# Altium schematic sheet AD9834.SchDoc
size A4
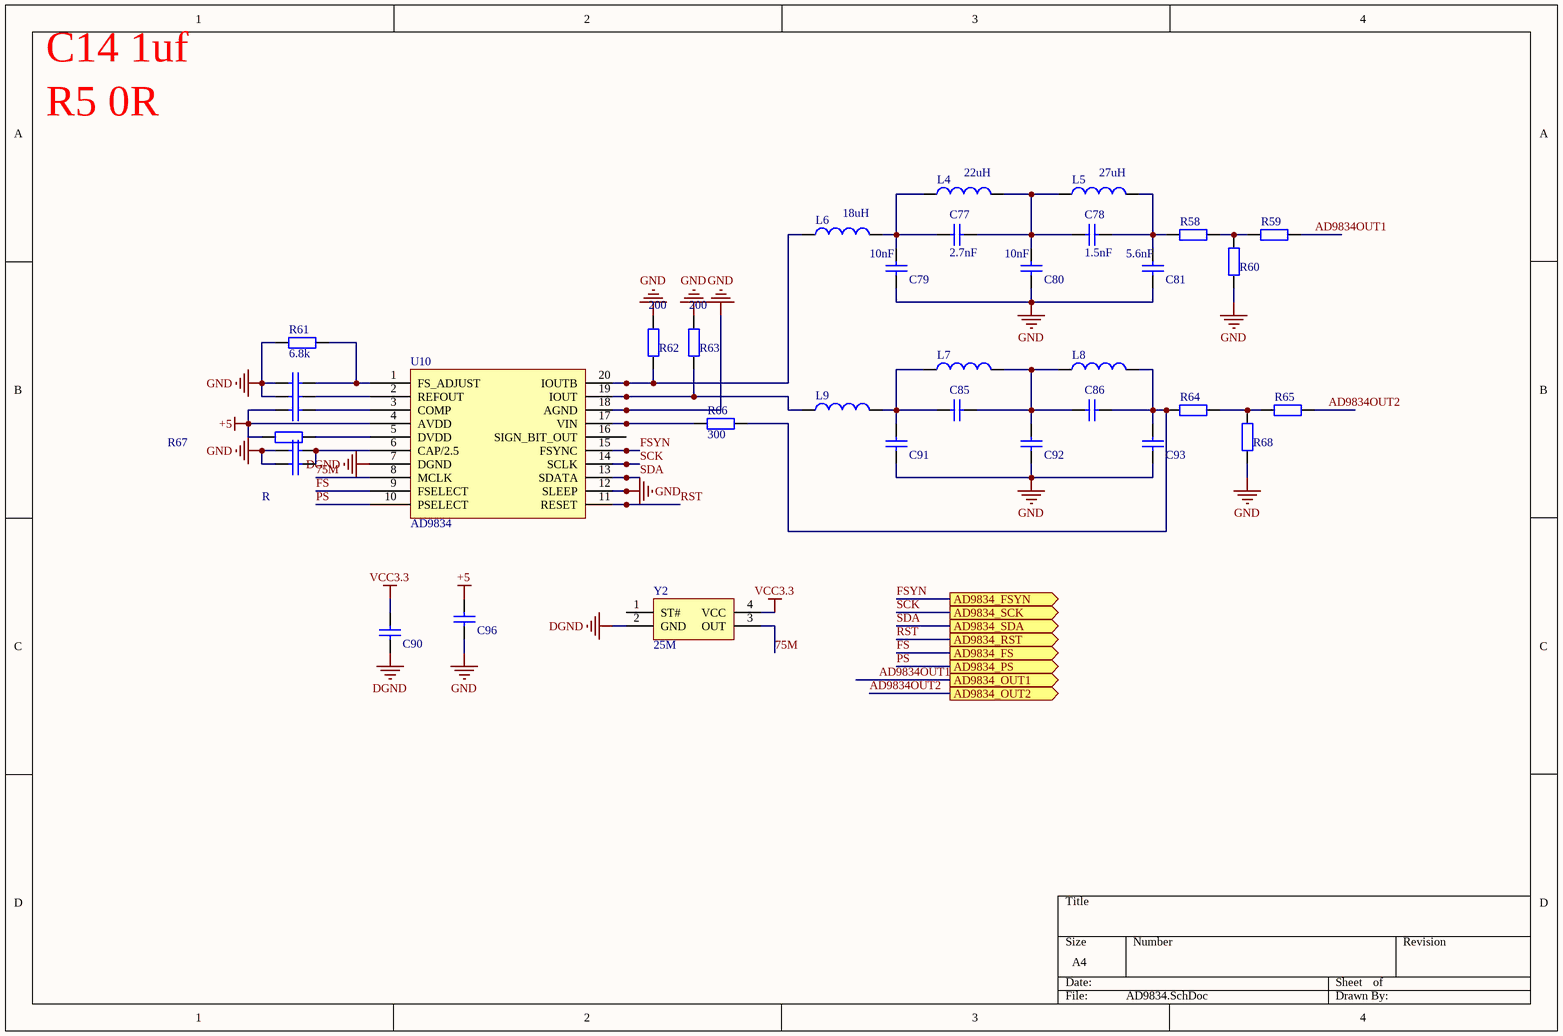
[diagram p0: AD9834.SchDoc]

## Parts
C77  2.7nF  [0603_C]
C78  1.5nF  [0603_C]
C79  10nF  [0603_C]
C80  10nF  [0603_C]
C81  5.6nF  [0603_C]
C82  10nF (103) 10% 50V  [0603_C]  (value not drawn)
C83  10nF (103) 10% 50V  [0603_C]  (value not drawn)
C84  10nF (103) 10% 50V  [0603_C]  (value not drawn)
C85  10nF (103) 10% 50V  [0603_C]  (value not drawn)
C86  10nF (103) 10% 50V  [0603_C]  (value not drawn)
C87  10nF (103) 10% 50V  [0603_C]  (value not drawn)
C89  10nF (103) 10% 50V  [0603_C]  (value not drawn)
C90  10nF (103) 10% 50V  [0603_C]  (value not drawn)
C91  10nF (103) 10% 50V  [0603_C]  (value not drawn)
C92  10nF (103) 10% 50V  [0603_C]  (value not drawn)
C93  10nF (103) 10% 50V  [0603_C]  (value not drawn)
C96  10nF (103) 10% 50V  [0603_C]  (value not drawn)
L4  22uH  [0603_L]
L5  27uH  [0603_L]
L6  18uH  [0603_L]
L7  699.1nH  [0603_L]  (value not drawn)
L8  596.4nH  [0603_L]  (value not drawn)
L9  22uH  [0603_L]  (value not drawn)
R58  110Ω (1100) ±1%  [0603_R]  (value not drawn)
R59  110Ω (1100) ±1%  [0603_R]  (value not drawn)
R60  110Ω (1100) ±1%  [0603_R]  (value not drawn)
R61  6.8k  [0603_R]
R62  200  [0603_R]
R63  200  [0603_R]
R64  110Ω (1100) ±1%  [0603_R]  (value not drawn)
R65  110Ω (1100) ±1%  [0603_R]  (value not drawn)
R66  300  [0603_R]
R67  R  [R_0603]
R68  110Ω (1100) ±1%  [0603_R]  (value not drawn)
U10  AD9834  [TSSOP20_N]
Y2  value 25M  [OSC 3225-4P]  (hidden comment: CRYSTAL)

## Ports
AD9834_FS (out), AD9834_FSYN (out), AD9834_OUT1 (out), AD9834_OUT2 (out), AD9834_PS (out), AD9834_RST (out), AD9834_SCK (out), AD9834_SDA (out)

## Nets
+5: C84.1 C96.2 R67.1 U10.4(AVDD)
DGND: C90.1 U10.7(DGND) Y2.2(GND)
GND: C79.1 C80.1 C81.1 C82.1 C83.1 C87.1 C89.1 C91.1 C92.1 C93.1 C96.1 R60.1 R61.2 R62.2 R63.2 R68.1 U10.12(SLEEP) U10.18(AGND)
VCC3.3: C90.2 Y2.4(VCC)
75M: U10.8(MCLK) Y2.3(OUT)
AD9834OUT1: R59.2 ; port AD9834_OUT1
AD9834OUT2: R65.2 ; port AD9834_OUT2
FS: U10.9(FSELECT) ; port AD9834_FS
FSYN: U10.15(FSYNC) ; port AD9834_FSYN
PS: U10.10(PSELECT) ; port AD9834_PS
RST: U10.11(RESET) ; port AD9834_RST
SCK: U10.14(SCLK) ; port AD9834_SCK
SDA: U10.13(SDATA) ; port AD9834_SDA
NetC77_1: C77.1 C79.2 L4.1 L6.2
NetC77_2: C77.2 C78.1 C80.2 L4.2 L5.1
NetC78_2: C78.2 C81.2 L5.2 R58.1
NetC82_2: C82.2 R61.1 U10.1(FS_ADJUST)
NetC83_2: C83.2 U10.2(REFOUT)
NetC84_2: C84.2 U10.3(COMP)
NetC85_1: C85.1 C91.2 L7.1 L9.2
NetC85_2: C85.2 C86.1 C92.2 L7.2 L8.1
NetC86_2: C86.2 C93.2 L8.2 R64.1 R66.2
NetC87_2: C87.2 C89.2 U10.6(CAP/2.5)
NetL6_1: L6.1 R62.1 U10.20(IOUTB)
NetL9_1: L9.1 R63.1 U10.19(IOUT)
NetR58_2: R58.2 R59.1 R60.2
NetR64_2: R64.2 R65.1 R68.2
NetR66_1: R66.1 U10.17(VIN)
NetR67_2: R67.2 U10.5(DVDD)

Not connected (* = marked no-connect by the designer): U10 16(SIGN_BIT_OUT); Y2 1(ST#)

## Notes on the sheet
- C14 1uf
- R5 0R

## Library data of the parts
C77-C87 C89-C93 C96 = 0603 10nF (103) 10% 50V: 贴片电容; ComponentLink1Description: 供应商链接; ComponentLink1URL: http://www.szlcsc.com/product/details_58143.html; Package: 0603; Supplier: LC; SuppliersPartNumber: C57112
L4-L9 = Inductor: Code_IEC: 1005; Value: 10mH; Published: 8-Jun-2000; LatestRevisionDate: 29-May-2009; LatestRevisionNote: IPC-7351 Footprint Added.; PackageReference: 0402-A; Publisher: Altium Limited; PackageDescription: Chip Inductor; Code_JEITA: 0402
R58-R66 R68 = 0603 110Ω (1100) 1%: 贴片电阻; ComponentLink1Description: 供应商链接; ComponentLink1URL: http://www.szlcsc.com/product/details_23508.html; Package: 0603; Supplier: LC; SuppliersPartNumber: C22781
R67 = Res
Y2 = CRYSTAL_有源晶振-25M-3225-4P